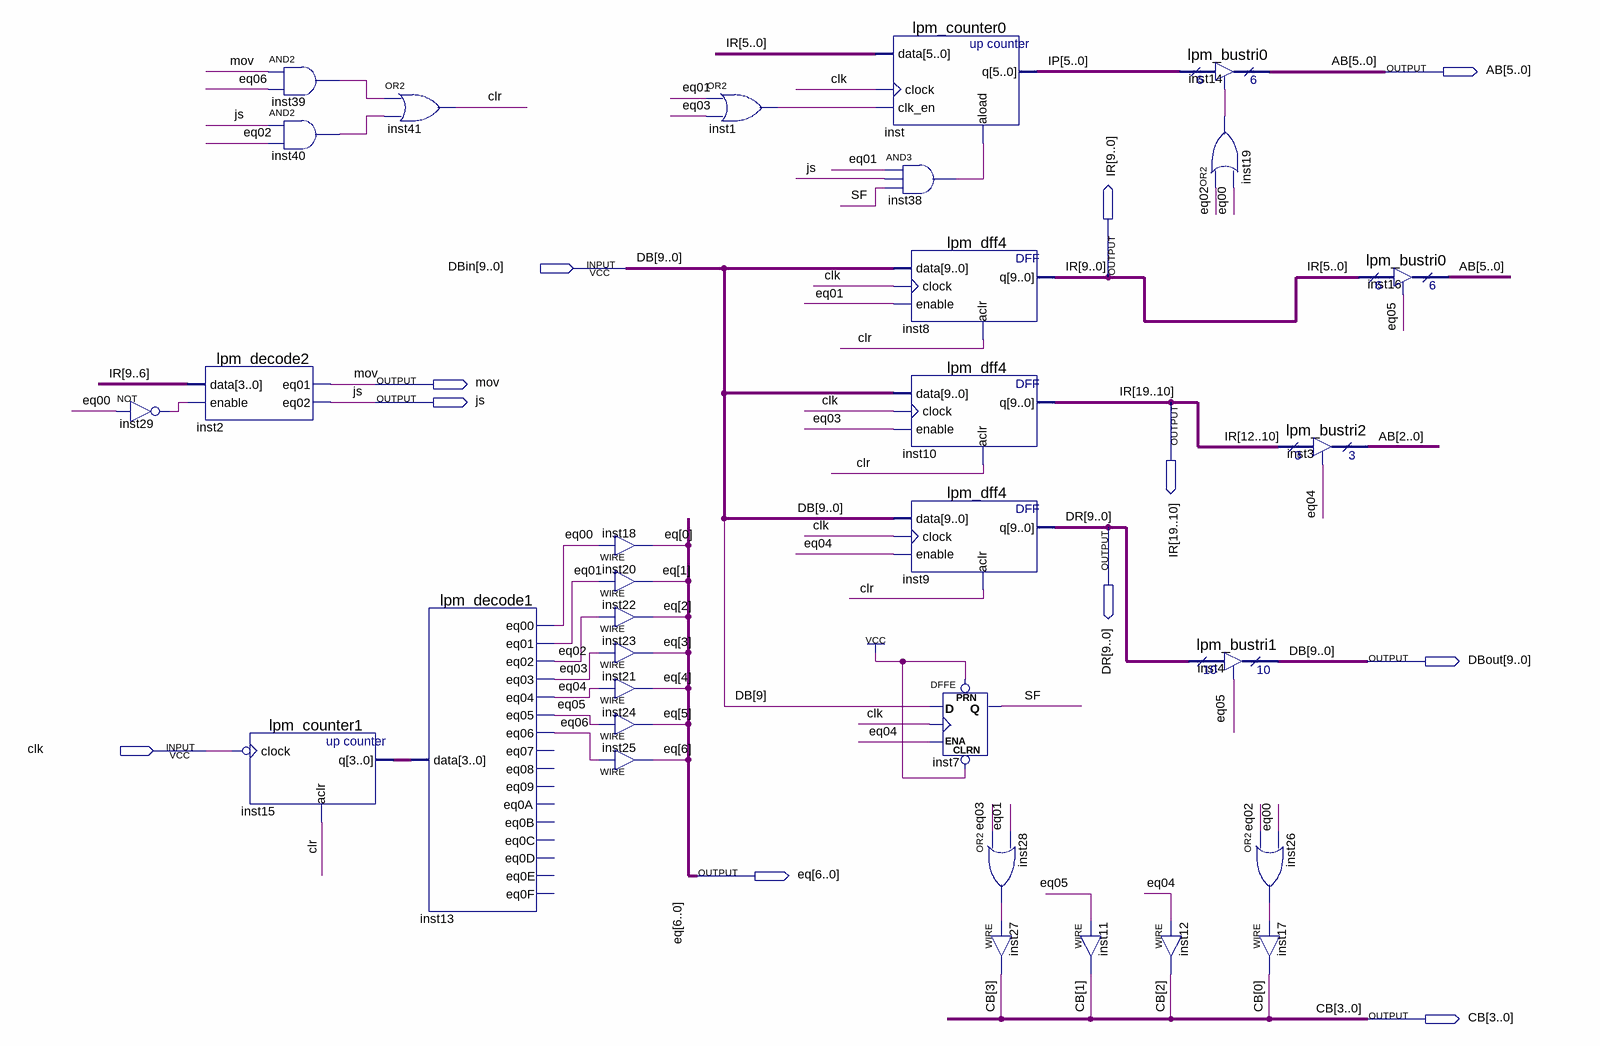
[diagram p0: schematic sheet]
// Quartus schematic CB.bdf as structural Verilog: 32 symbols, 11 pins
module CB (
  input  [9:0] DBin,
  input  clk,
  output [5:0] AB,
  output [19:0] IR,
  output mov,
  output js,
  output [9:0] DR,
  output [9:0] DBout,
  output [6:0] eq,
  output [3:0] CB
);

  wire clr, eq00, eq01, eq02, eq03, eq04, eq05, eq06, inst1_out, inst19_out, inst26_out, inst28_out,
       inst29_out, inst38_out, inst39_out, inst40_out, SF;
  wire [3:0] inst15_q;
  wire [5:0] IP;

  not inst29 (inst29_out, eq00);
  lpm_decode2 inst2 (.data(IR[9:6]), .enable(inst29_out), .eq01(mov), .eq02(js));
  and inst39 (inst39_out, mov, eq06);
  and inst40 (inst40_out, js, eq02);
  lpm_counter1 inst15 (.clock(~clk), .aclr(clr), .q(inst15_q));
  or inst41 (clr, inst39_out, inst40_out);
  lpm_decode1 inst13 (
    .data(inst15_q), .eq00(eq00), .eq01(eq01), .eq02(eq02), .eq03(eq03), .eq04(eq04), .eq05(eq05), .eq06(eq06));  // open: eq07, eq08, eq09, eq0A, eq0B, eq0C, eq0D, eq0E, eq0F
  assign eq[0] = eq00;  // WIRE inst18
  assign eq[1] = eq01;  // WIRE inst20
  assign eq[2] = eq02;  // WIRE inst22
  assign eq[3] = eq03;  // WIRE inst23
  assign eq[4] = eq04;  // WIRE inst21
  assign eq[5] = eq05;  // WIRE inst24
  assign eq[6] = eq06;  // WIRE inst25
  or inst1 (inst1_out, eq01, eq03);
  lpm_counter0 inst (.data(IR[5:0]), .clock(clk), .clk_en(inst1_out), .aload(inst38_out), .q(IP));
  and inst38 (inst38_out, eq01, js, SF);
  lpm_dff4 inst8 (.data(DBin), .clock(clk), .enable(eq01), .aclr(clr), .q(IR[9:0]));
  lpm_dff4 inst10 (.data(DBin), .clock(clk), .enable(eq03), .aclr(clr), .q(IR[19:10]));
  lpm_dff4 inst9 (.data(DBin), .clock(clk), .enable(eq04), .aclr(clr), .q(DR));
  DFFE inst7 (.PRN(1'b1), .CLRN(1'b1), .D(DBin[9]), .CLK(clk), .ENA(eq04), .Q(SF));
  or inst28 (inst28_out, eq03, eq01);
  assign CB[3] = inst28_out;  // WIRE inst27
  assign CB[1] = eq05;  // WIRE inst11
  lpm_bustri0 inst14 (.enabledt(inst19_out), .data(IP), .tridata(AB));
  or inst19 (inst19_out, eq02, eq00);
  lpm_bustri1 inst4 (.enabledt(eq05), .data(DR), .tridata(DBin));
  assign CB[2] = eq04;  // WIRE inst12
  or inst26 (inst26_out, eq02, eq00);
  assign CB[0] = inst26_out;  // WIRE inst17
  lpm_bustri2 inst3 (.enabledt(eq04), .data(IR[12:10]), .tridata(AB[2:0]));
  lpm_bustri0 inst16 (.enabledt(eq05), .data(IR[5:0]), .tridata(AB));

  assign DBout = DBin;

  // Other names for the same wires on the sheet: DB[9:0] = DBin
endmodule
